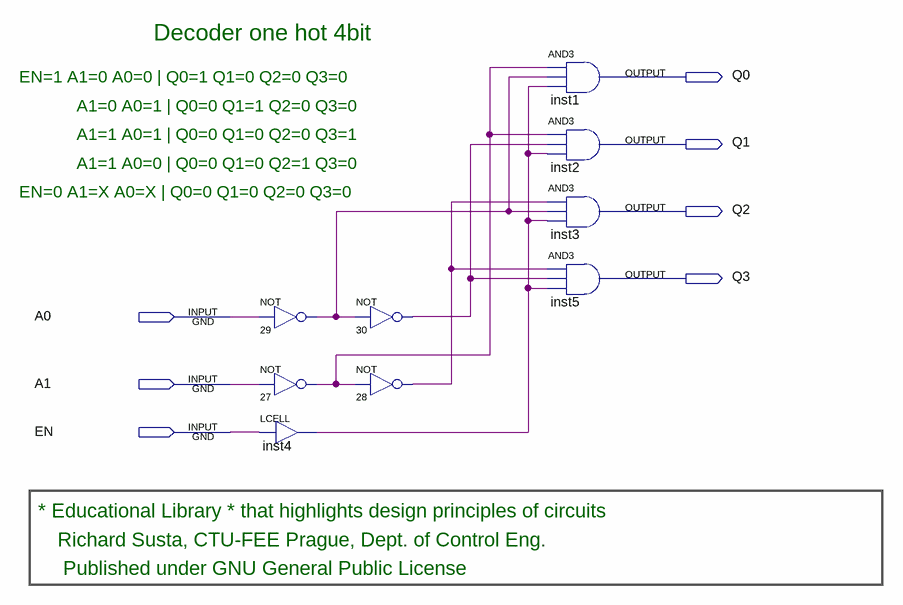
[diagram p0: schematic sheet]
// Quartus schematic onehot4.bdf as structural Verilog: 9 symbols, 7 pins
module onehot4 (
  input  A0,
  input  A1,
  input  EN,
  output Q0,
  output Q1,
  output Q2,
  output Q3
);

  wire inst4_out, n27_out, n28_out, n29_out, n30_out;

  not u_29 (n29_out, A0);
  not u_27 (n27_out, A1);
  LCELL inst4 (.IN(EN), .OUT(inst4_out));
  not u_30 (n30_out, n29_out);
  not u_28 (n28_out, n27_out);
  and inst1 (Q0, n27_out, n29_out, inst4_out);
  and inst2 (Q1, n27_out, n30_out, inst4_out);
  and inst3 (Q2, n28_out, n29_out, inst4_out);
  and inst5 (Q3, n28_out, n30_out, inst4_out);

  // Notes on the sheet:
  //   Decoder one hot 4bit
  //   EN=1 A1=0 A0=0 | Q0=1 Q1=0 Q2=0 Q3=0
  //   A1=0 A0=1 | Q0=0 Q1=1 Q2=0 Q3=0
  //   A1=1 A0=1 | Q0=0 Q1=0 Q2=0 Q3=1
  //   A1=1 A0=0 | Q0=0 Q1=0 Q2=1 Q3=0
  //   EN=0 A1=X A0=X | Q0=0 Q1=0 Q2=0 Q3=0
  //   * Educational Library * that highlights design principles of circuits
  //   Richard Susta, CTU-FEE Prague, Dept. of Control Eng. 
  //    Published under GNU General Public License
endmodule
